# Altium schematic sheet thermistor-heater.SchDoc
size A
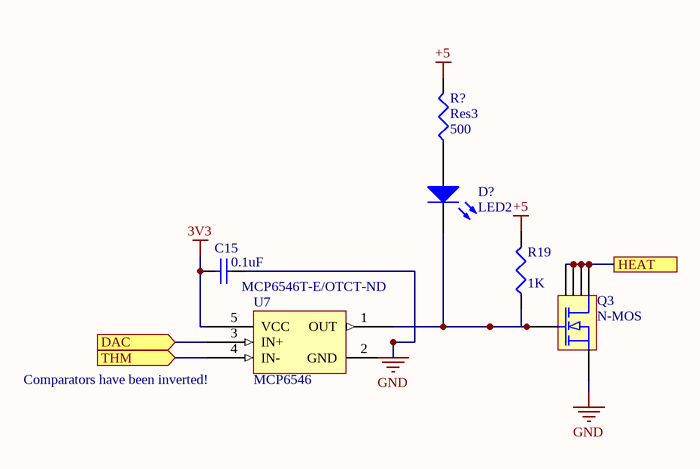
[diagram p0: thermistor-heater.SchDoc]

## Parts
C15  value 0.1uF  [1608[0603]]  (hidden comment: 100pF)
D?  LED2  [0603-LED]
Q3  N-MOS  [SOT23-6_N]
R19  1K  [J1-0603]
R?  Res3  value 500  [J1-0603]
U7  MCP6546  Supplier Part Number 1: MCP6546T-E/OTCT-ND  [SOT-23-5_95P290X160-5N]

## Ports
DAC (in), HEAT, THM (in)

## Nets
3V3: C15.1 U7.5(VCC)
+5: R19.2 R?.2
GND: C15.2 Q3.4(S) U7.2(GND)
DAC: U7.3(IN+) ; port DAC
HEAT: Q3.1(D) Q3.2(D) Q3.5(D) Q3.6(D) ; port HEAT
THM: U7.4(IN-) ; port THM
NetD?_1: D?.1(A) R?.1
NetD?_2: D?.2(K) Q3.3(G) R19.1 U7.1(OUT)

## Notes on the sheet
- (near U7) Comparators have been inverted!

## Library data of the parts
C15 = Cap Semi: Capacitor (Semiconductor SIM Model); Published: 8-Jun-2000; LatestRevisionDate: 29-May-2009; LatestRevisionNote: IPC-7351 Footprint Added.; PackageReference: C1206; Publisher: Altium Limited; PackageDescription: Chip Capacitor; Supplier: Digi-Key; Supplier Part Number: 490-1351-1-ND; Supplier 1: Digi-Key
D? = LED2: Typical RED, GREEN, YELLOW, AMBER GaAs LED; Published: 8-Jun-2000; LatestRevisionDate: 17-Jul-2002; LatestRevisionNote: Re-released for DXP Platform.; PackageVersion: Feb-2002; PackageReference: 3.2X1.6X1.1; Publisher: Altium Limited; PackageDescription: SM LED; 2 Flat Leads; Supplier 1: Digi-Key; Supplier: Digi-Key
Q3 = FDC637BNZCT-ND: N-MOS, low gate ON voltage; Supplier: Digi-Key; Supplier Part Number: FDC637BNZCT-ND; Supplier 1: Digi-Key
R19 R? = Res3: Resistor; Published: 8-Jun-2000; LatestRevisionDate: 29-May-2009; LatestRevisionNote: IPC-7351 Footprint Added.; PackageReference: J1-0603; Publisher: Altium Limited; PackageDescription: Chip Resistor; Supplier: Digi-Key; Supplier 1: Digi-Key
  R19: Value: 1K; Supplier Part Number: RNCP0603FTD1K00CT-ND
  R?: Supplier Part Number: RMCF0603JT510RCT-ND
U7 = MCP6546: Open-drain output sub-microamp comparator.; Supplier 1: Digi-Key; Supplier: Digi-Key; Supplier Part Number: MCP6546T-E/OTCT-ND